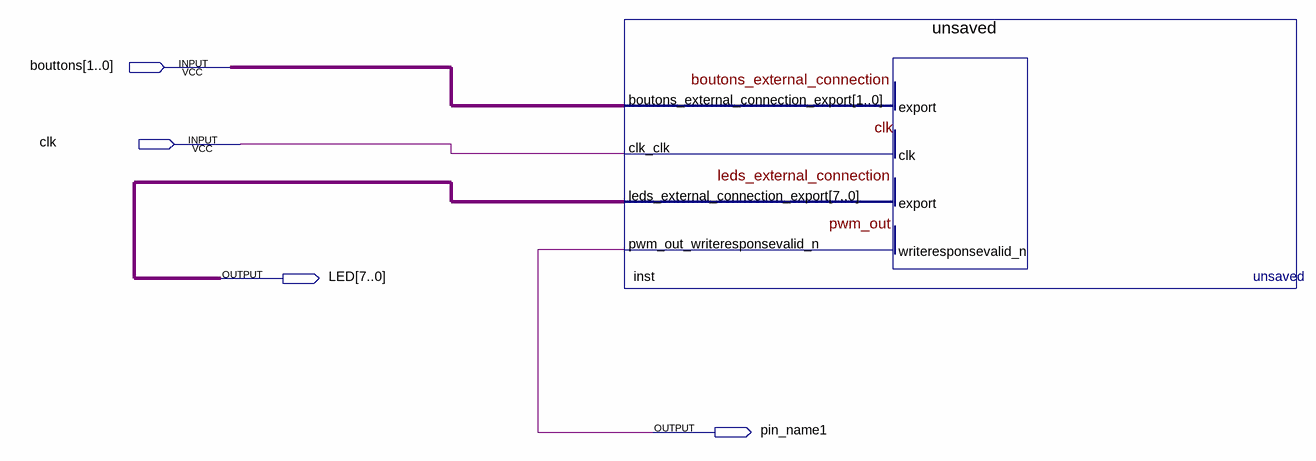
[diagram p0: schematic sheet]
// Quartus schematic sopc_compteur_old.bdf as structural Verilog: 1 symbols, 4 pins
module sopc_compteur_old (
  input  [1:0] bouttons,
  input  clk,
  output [7:0] LED,
  output pin_name1
);

  unsaved inst (
    .boutons_external_connection_export(bouttons), .clk_clk(clk), .leds_external_connection_export(LED),
    .pwm_out_writeresponsevalid_n(pin_name1));
endmodule
